# EAGLE schematic RAFT_DuckLink_NA (EAGLE 9.5.2)

## Sheet 1 of 4
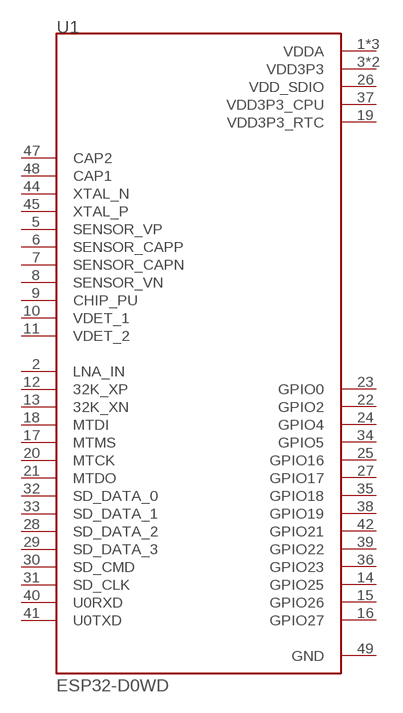
[diagram p0: schematic, sheet 1]

### Parts
U1  ESP32-D0WD  [QFN35P500X500X90-49N]
Unconnected: U1.2(LNA_IN) U1.5(SENSOR_VP) U1.6(SENSOR_CAPP) U1.7(SENSOR_CAPN) U1.8(SENSOR_VN) U1.9(CHIP_PU) U1.10(VDET_1) U1.11(VDET_2) U1.12(32K_XP) U1.13(32K_XN) U1.14(GPIO25) U1.15(GPIO26) U1.16(GPIO27) U1.17(MTMS) U1.18(MTDI) U1.20(MTCK) U1.21(MTDO) U1.22(GPIO2) U1.23(GPIO0) U1.24(GPIO4) U1.25(GPIO16) U1.27(GPIO17) U1.28(SD_DATA_2) U1.29(SD_DATA_3) U1.30(SD_CMD) U1.31(SD_CLK) U1.32(SD_DATA_0) U1.33(SD_DATA_1) U1.34(GPIO5) U1.35(GPIO18) U1.36(GPIO23) U1.38(GPIO19) U1.39(GPIO22) U1.40(U0RXD) U1.41(U0TXD) U1.42(GPIO21) U1.44(XTAL_N) U1.45(XTAL_P) U1.47(CAP2) U1.48(CAP1)

## Sheet 2 of 4
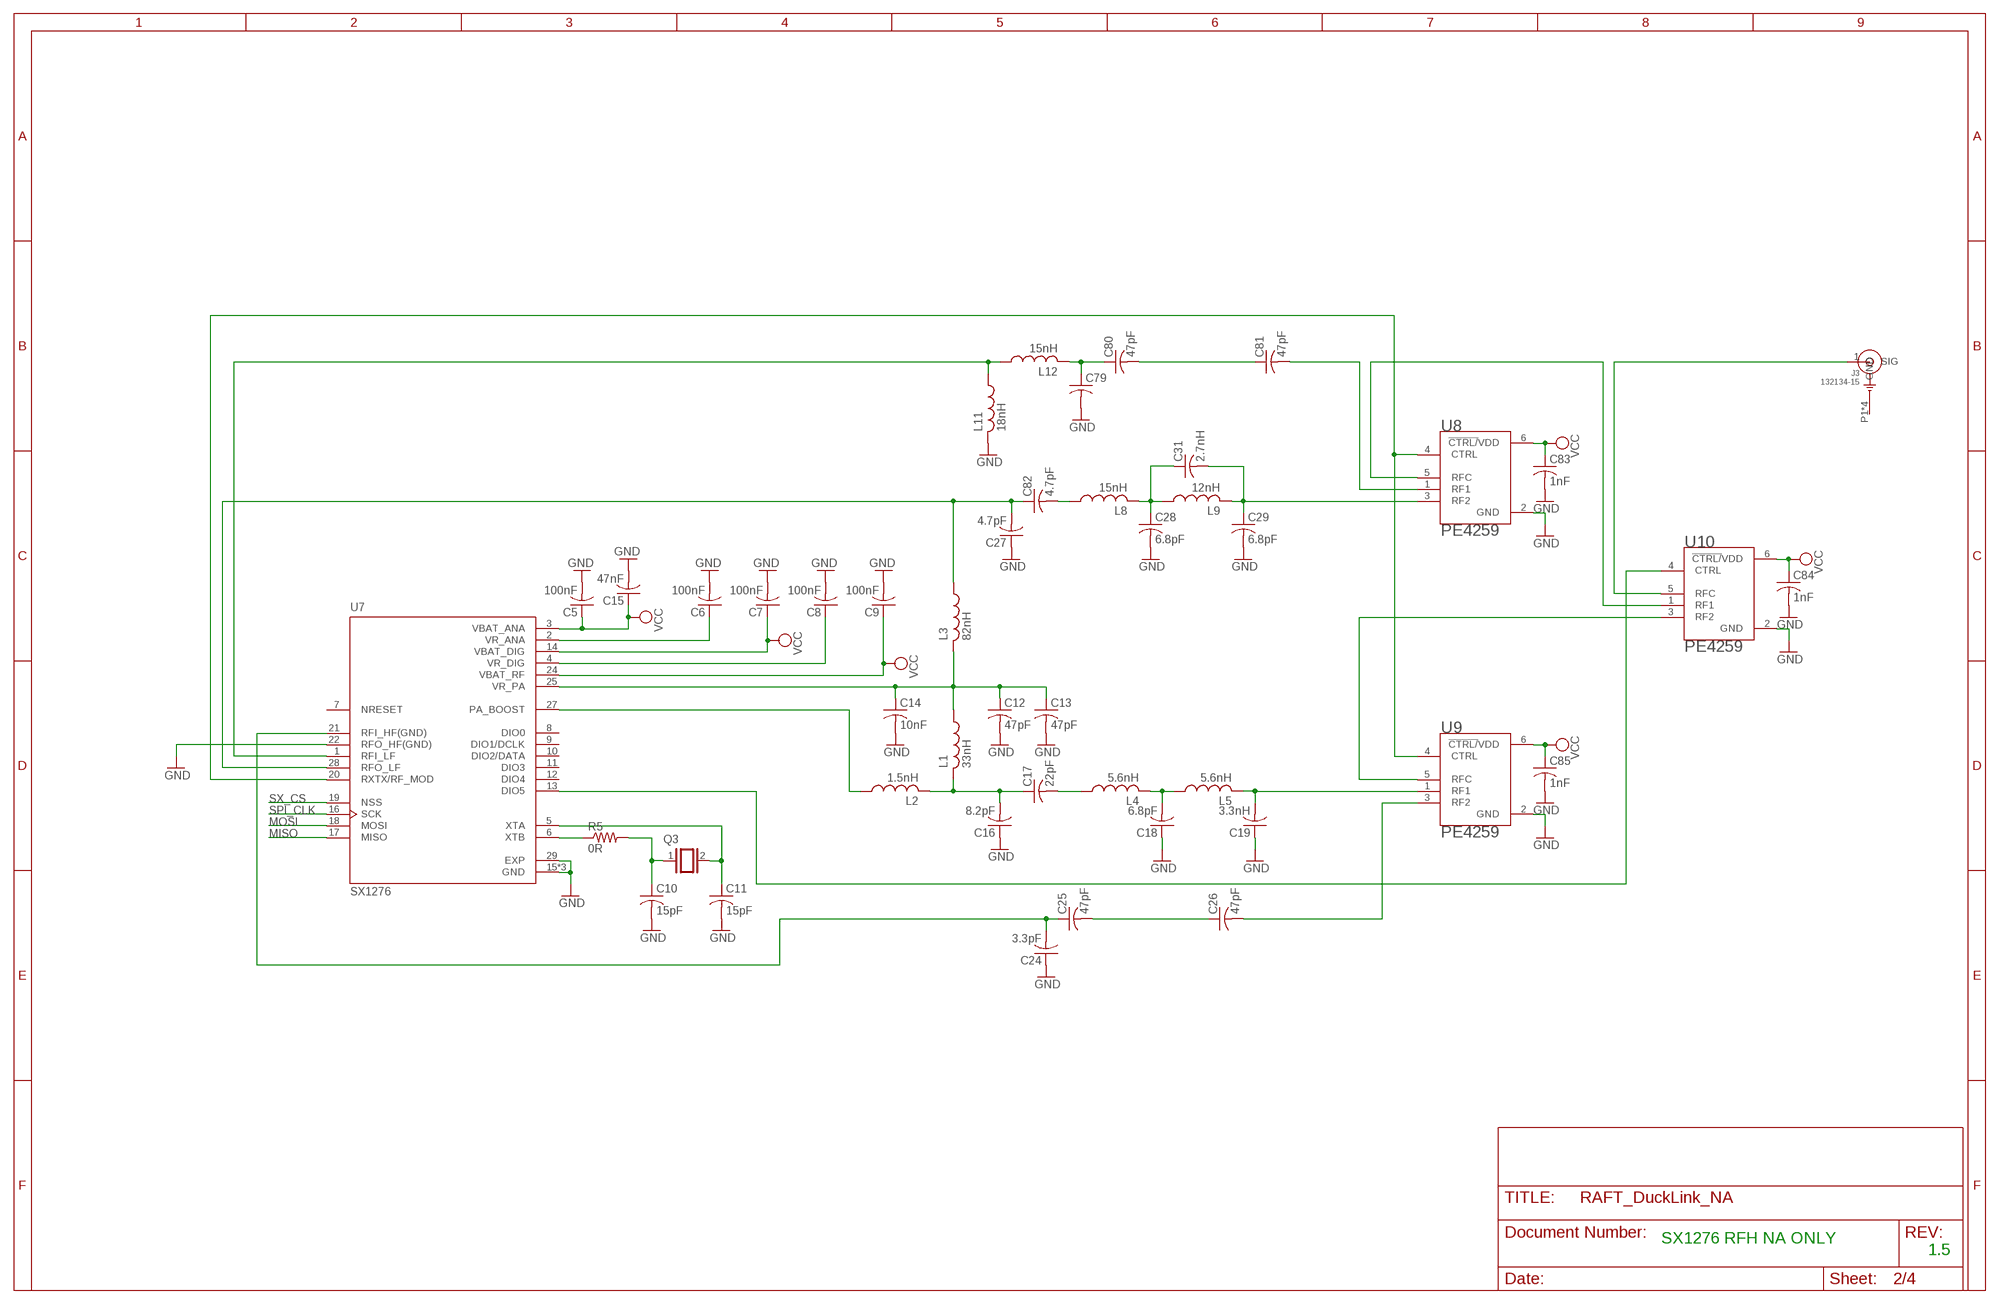
[diagram p1: schematic, sheet 2]

### Parts
C5  100nF  C-USC0805  [C0805]
C6  100nF  C-USC0805  [C0805]
C7  100nF  C-USC0805  [C0805]
C8  100nF  C-USC0805  [C0805]
C9  100nF  C-USC0805  [C0805]
C10  15pF  C-USC0805  [C0805]
C11  15pF  C-USC0805  [C0805]
C12  47pF  C-USC0805  [C0805]
C13  47pF  C-USC0805  [C0805]
C14  10nF  C-USC0805  [C0805]
C15  47nF  C-USC0805  [C0805]
C16  8.2pF  C-USC0805  [C0805]
C17  22pF  C-USC0805  [C0805]
C18  6.8pF  C-USC0805  [C0805]
C19  3.3nH  C-USC0805  [C0805]
C24  3.3pF  C-USC0805  [C0805]
C25  47pF  C-USC0805  [C0805]
C26  47pF  C-USC0805  [C0805]
C27  4.7pF  C-USC0805  [C0805]
C28  6.8pF  C-USC0805  [C0805]
C29  6.8pF  C-USC0805  [C0805]
C31  2.7nH  C-USC0805  [C0805]
C79  C-USC0805  [C0805]
C80  47pF  C-USC0805  [C0805]
C81  47pF  C-USC0805  [C0805]
C82  4.7pF  C-USC0805  [C0805]
C83  1nF  C-USC0805  [C0805]
C84  1nF  C-USC0805  [C0805]
C85  1nF  C-USC0805  [C0805]
J3  132134-15  [AMPHENOL_132134-15]
L1  33nH  L-USL3225M  [L3225M]
L2  1.5nH  L-USL3225M  [L3225M]
L3  82nH  L-USL3225M  [L3225M]
L4  5.6nH  L-USL3225M  [L3225M]
L5  5.6nH  L-USL3225M  [L3225M]
L8  15nH  L-USL3225M  [L3225M]
L9  12nH  L-USL3225M  [L3225M]
L11  18nH  L-USL3225M  [L3225M]
L12  15nH  L-USL3225M  [L3225M]
Q3  XTAL/S  [QS]
R5  0R  R-US_R0805  [R0805]
U7  SX1276  [QFN65P600X600X100-29N]
U8  PE4259  [SOT65P215X110-6N]
U9  PE4259  [SOT65P215X110-6N]
U10  PE4259  [SOT65P215X110-6N]

### Nets
GND: C5.2 C6.2 C7.2 C8.2 C9.2 C10.2 C11.2 C12.2 C13.2 C14.2 C15.2 C16.1 C18.1 C19.1 C24.1 C27.1 C28.2 C29.2 C79.2 C83.2 C84.2 C85.2 L11.2 U7.15(GND) U7.22(RFO_HF(GND)) U7.23(GND) U7.26(GND) U7.29(EXP) U8.2(GND) U9.2(GND) U10.2(GND) ; also sheet 3
MISO: U7.17(MISO)
MOSI: U7.18(MOSI)
N$9: C6.1 U7.2(VR_ANA)
N$10: C8.1 U7.4(VR_DIG)
N$11: C10.1 Q3.1 R5.2
N$12: C11.1 Q3.2 U7.5(XTA)
N$13: R5.1 U7.6(XTB)
N$14: C12.1 C13.1 C14.1 L1.1 L3.2 U7.25(VR_PA)
N$15: L2.1 U7.27(PA_BOOST)
N$16: C27.2 C82.1 L3.1 U7.28(RFO_LF)
N$17: C17.2 L4.1
N$18: C18.2 L4.2 L5.1
N$19: C19.2 L5.2 U9.1(RF1)
N$20: C80.2 C81.1
N$21: C24.2 C25.1 U7.21(RFI_HF(GND))
N$23: C25.2 C26.1
N$33: C26.2 U9.3(RF2)
N$62: C16.2 C17.1 L1.2 L2.2
N$63: C28.1 C31.1 L8.2 L9.1
N$64: C29.1 C31.2 L9.2 U8.3(RF2)
N$67: L11.1 L12.1 U7.1(RFI_LF)
N$68: C79.1 C80.1 L12.2
N$71: C81.2 U8.1(RF1)
N$72: C82.2 L8.1
N$73: U7.20(RXTX/RF_MOD) U8.4(CTRL) U9.4(CTRL)
N$74: U8.5(RFC) U10.1(RF1)
N$75: U9.5(RFC) U10.3(RF2)
N$76: J3.1(SIG) U10.5(RFC)
N$77: U7.13(DIO5) U10.4(CTRL)
SPI_CLK: U7.16(SCK)
SX_CS: U7.19(NSS)
VCC: C5.1 C7.1 C9.1 C15.1 C83.1 C84.1 C85.1 U7.3(VBAT_ANA) U7.14(VBAT_DIG) U7.24(VBAT_RF) U8.6(!CTRL/!VDD) U9.6(!CTRL/!VDD) U10.6(!CTRL/!VDD) ; also sheet 3
Unconnected: J3.P1(GND) J3.P2(GND) J3.P3(GND) J3.P4(GND) U7.7(NRESET) U7.8(DIO0) U7.9(DIO1/DCLK) U7.10(DIO2/DATA) U7.11(DIO3) U7.12(DIO4)

### Notes on the sheet
- SX1276 RFH NA ONLY
- 1.5

## Sheet 3 of 4
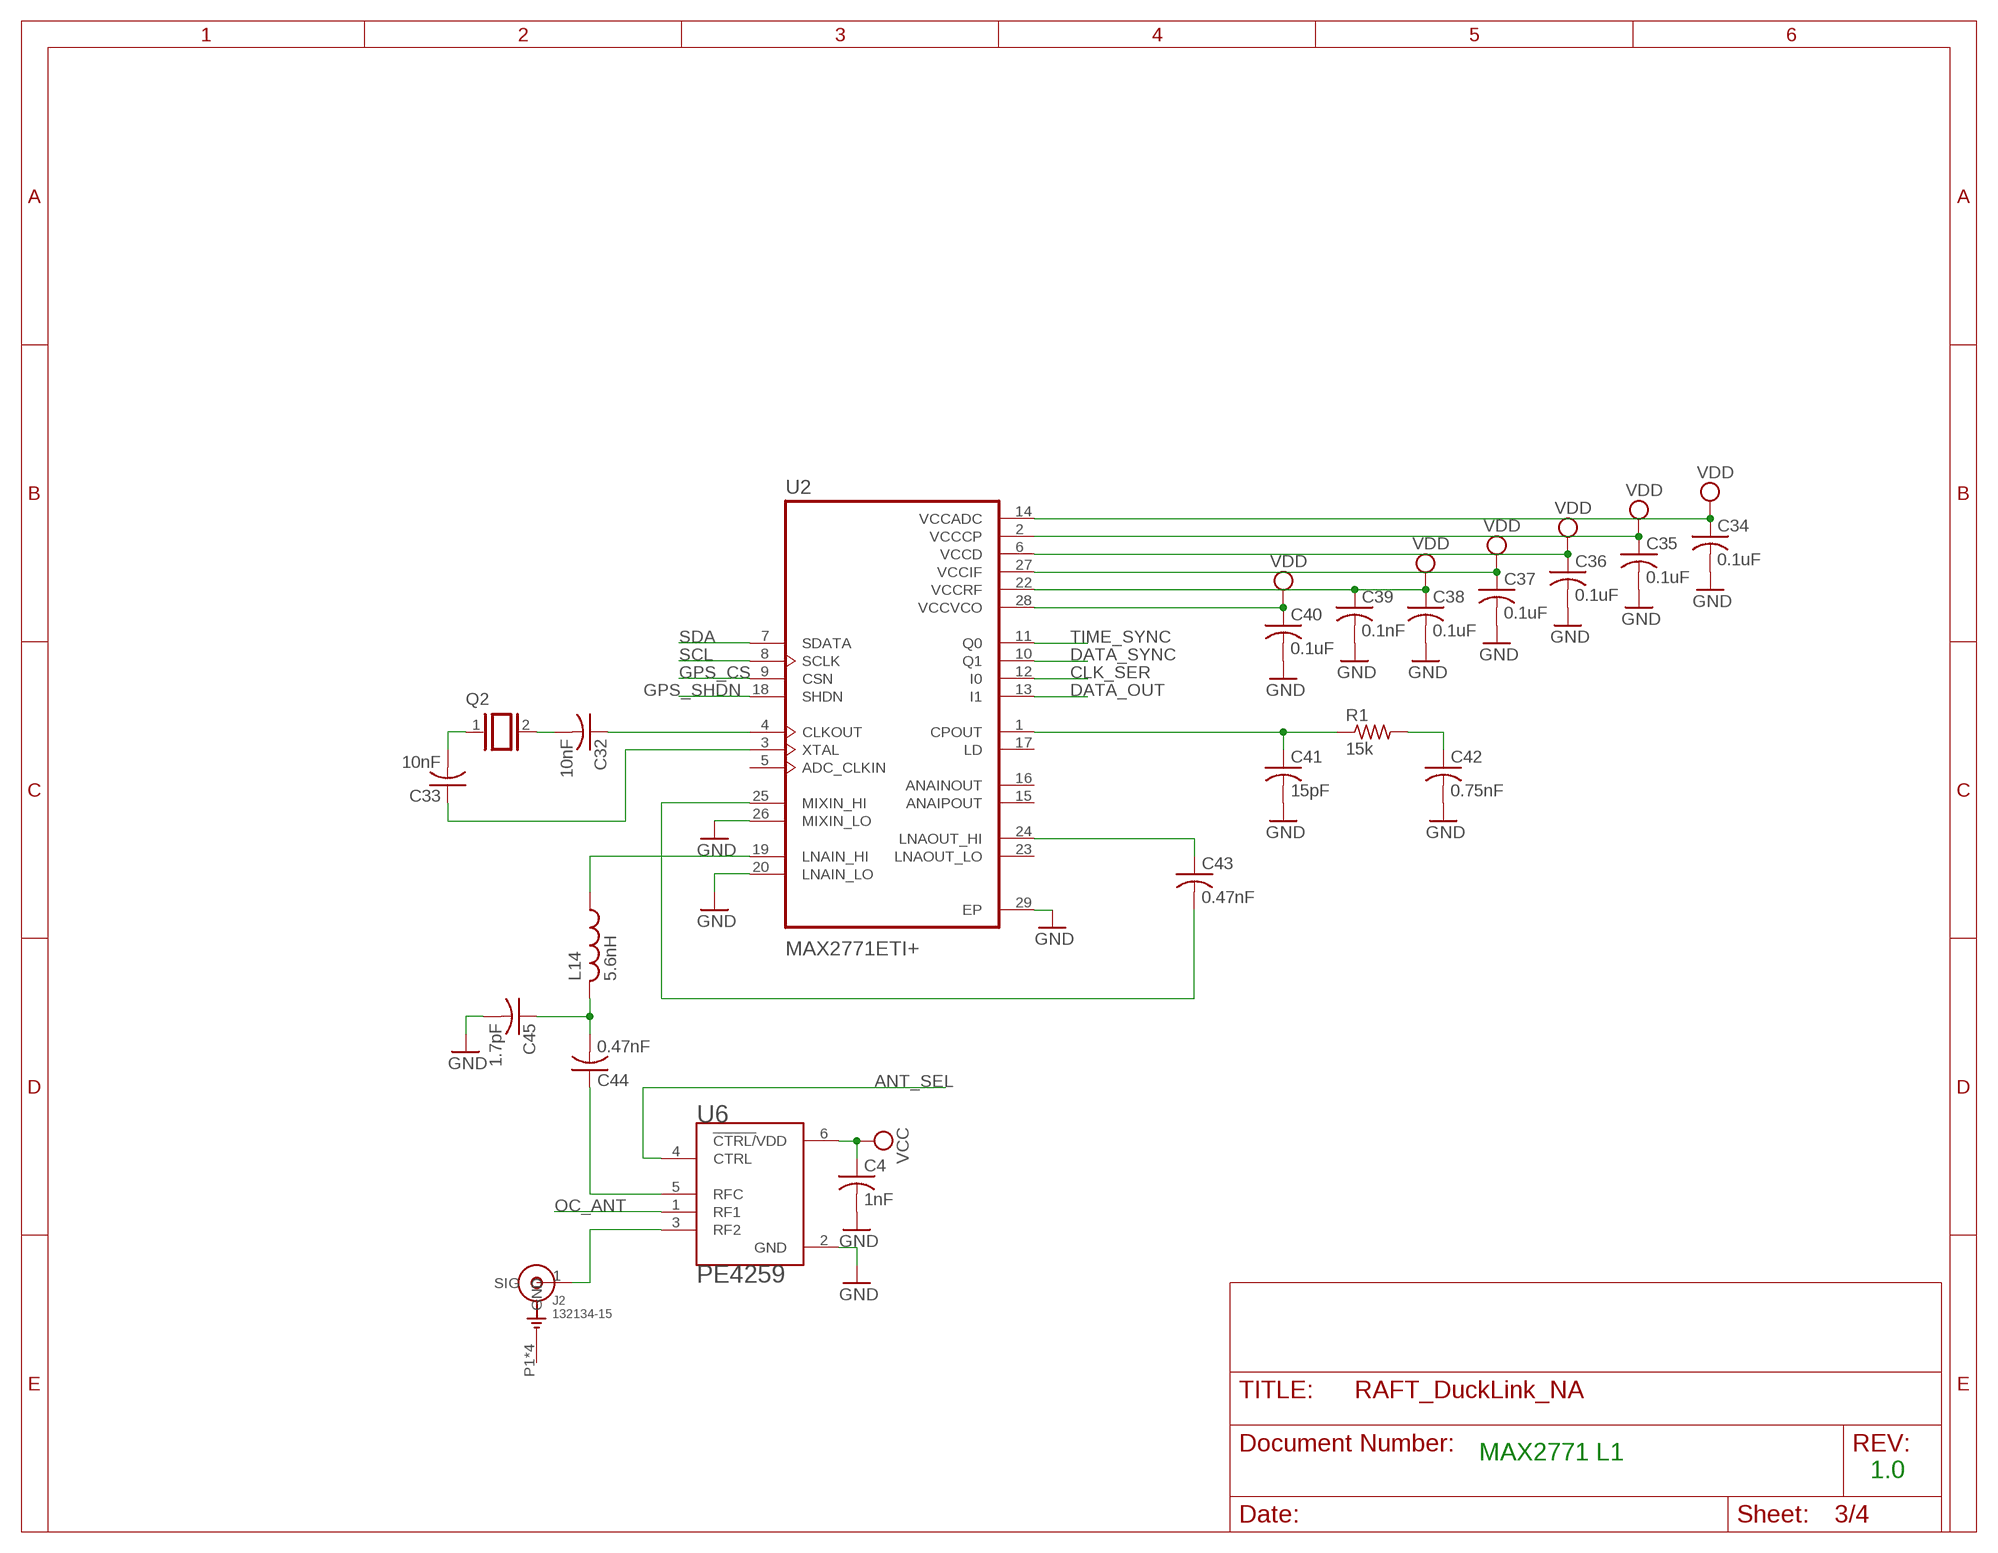
[diagram p2: schematic, sheet 3]

### Parts
C4  1nF  C-USC0805  [C0805]
C32  10nF  C-US050-030X075  [C050-030X075]
C33  10nF  C-US050-030X075  [C050-030X075]
C34  0.1uF  C-US050-030X075  [C050-030X075]
C35  0.1uF  C-US050-030X075  [C050-030X075]
C36  0.1uF  C-US050-030X075  [C050-030X075]
C37  0.1uF  C-US050-030X075  [C050-030X075]
C38  0.1uF  C-US050-030X075  [C050-030X075]
C39  0.1nF  C-US050-030X075  [C050-030X075]
C40  0.1uF  C-US050-030X075  [C050-030X075]
C41  15pF  C-US050-030X075  [C050-030X075]
C42  0.75nF  C-US050-030X075  [C050-030X075]
C43  0.47nF  C-USC0805  [C0805]
C44  0.47nF  C-USC0805  [C0805]
C45  1.7pF  C-USC0805  [C0805]
J2  132134-15  [AMPHENOL_132134-15]
L14  5.6nH  L-USL3225M  [L3225M]
Q2  XTAL/S  [QS]
R1  15k  R-US_R0805  [R0805]
U2  MAX2771ETI+  [QFN50P500X500X80-29N]
U6  PE4259  [SOT65P215X110-6N]

### Nets
ANT_SEL: U6.4(CTRL)
CLK_SER: U2.12(I0)
DATA_OUT: U2.13(I1)
DATA_SYNC: U2.10(Q1)
GND: C4.2 C34.2 C35.2 C36.2 C37.2 C38.2 C39.2 C40.2 C41.2 C42.2 C45.2 U2.20(LNAIN_LO) U2.26(MIXIN_LO) U2.29(EP) U6.2(GND) ; also sheet 2
GPS_CS: U2.9(CSN)
GPS_SHDN: U2.18(SHDN)
N$5: C44.1 U6.5(RFC)
N$6: C33.2 Q2.1
N$7: J2.1(SIG) U6.3(RF2)
N$8: C33.1 U2.3(XTAL)
N$24: C32.2 Q2.2
N$25: C32.1 U2.4(CLKOUT)
N$27: C41.1 R1.1 U2.1(CPOUT)
N$28: C42.1 R1.2
N$29: L14.1 U2.19(LNAIN_HI)
N$30: C43.1 U2.24(LNAOUT_HI)
N$31: C44.2 C45.1 L14.2
N$32: C43.2 U2.25(MIXIN_HI)
OC_ANT: U6.1(RF1)
SCL: U2.8(SCLK)
SDA: U2.7(SDATA)
TIME_SYNC: U2.11(Q0)
VCC: C4.1 U6.6(!CTRL/!VDD) ; also sheet 2
VDD: C34.1 C35.1 C36.1 C37.1 C38.1 C39.1 C40.1 U2.2(VCCCP) U2.6(VCCD) U2.14(VCCADC) U2.22(VCCRF) U2.27(VCCIF) U2.28(VCCVCO)
Unconnected: J2.P1(GND) J2.P2(GND) J2.P3(GND) J2.P4(GND) U2.5(ADC_CLKIN) U2.15(ANAIPOUT) U2.16(ANAINOUT) U2.17(LD) U2.23(LNAOUT_LO)

### Notes on the sheet
- MAX2771 L1
- 1.0

## Sheet 4 of 4

## Power pins joined to a net without a drawn wire
GND: U1.49(GND)
VDD3P3: U1.3(VDD3P3) U1.4(VDD3P3)
VDD3P3_CPU: U1.37(VDD3P3_CPU)
VDD3P3_RTC: U1.19(VDD3P3_RTC)
VDD_SDIO: U1.26(VDD_SDIO)
VDDA: U1.1(VDDA) U1.43(VDDA) U1.46(VDDA)

## Library data of the parts
C4-C19 C24-C29 C31 C43-C45 C79-C85 = rcl:C-US: CAPACITOR, American symbol; SPICEPREFIX: C
C32-C42 = rcl:C-US: CAPACITOR, American symbol; SPICEPREFIX: 100nF
J2 J3 = 132134-15:132134-15: Rf Coaxial, Sma, Straight Jack, Pcb; AVAILABILITY: Unavailable; DESCRIPTION: RF Connector SMA Straight PCB Jack Surface Mount 50 Ohm; MF: Amphenol RF; MP: 132134-15; PACKAGE: None; PRICE: None
L1-L5 L8 L9 L11 L12 L14 = rcl:L-US: INDUCTOR, American symbol; SPICEPREFIX: L
Q2 Q3 = special:XTAL/S: CRYSTAL
R1 R5 = rcl:R-US_: RESISTOR, American symbol; SPICEPREFIX: R
U1 = ESP32-D0WD:ESP32-D0WD: ESP32 is a single 2.4 GHz Wi-Fi-and-Bluetooth combo chip designed with the TSMC ultra-low-power 40 nm technology. It is designed to achieve the best power and RF performance, showing robustness, versatility and reliability in a wide variety of applications and power scenarios.; AVAILABILITY: Unavailable; DESCRIPTION: Smd Ic Esp32-D0wd, Dual Core Mcu; MF: Espressif Systems; MP: ESP32-D0WD; PACKAGE: VFQFN-48 Espressif Systems; PRICE: None
U2 = MAX2771ETI_:MAX2771ETI+: None; AVAILABILITY: Unavailable; DESCRIPTION: NEXT-GENERATION GLOBAL NAVIGATIO; MF: Maxim Integrated; MP: MAX2771ETI+; PACKAGE: TQFN-28 Maxim; PRICE: None
U6 U8-U10 = PE4259:PE4259: SPDT High Power UltraCMOS 10 MHz–3.0 GHz RF Switch; AVAILABILITY: Unavailable; MF: pSemi; MP: PE4259; PACKAGE: SOT-363 Peregrine Semiconductor; PRICE: None
U7 = SX1276:SX1276: RF Transceiver FSK/GFSK/MSK/GMSK/LoRa/OOK 137MHz to 1020MHz 28-Pin QFN; AVAILABILITY: Unavailable; DESCRIPTION: RF Transceiver FSK/GFSK/MSK/GMSK/LoRa/OOK 137MHz to 1020MHz 28-Pin QFN; MF: Semtech Corporation; MP: SX1276; PACKAGE: VQFN-28 Semtech Corporation; PRICE: None